# EAGLE schematic Eagle_Template (EAGLE 9.1.3)
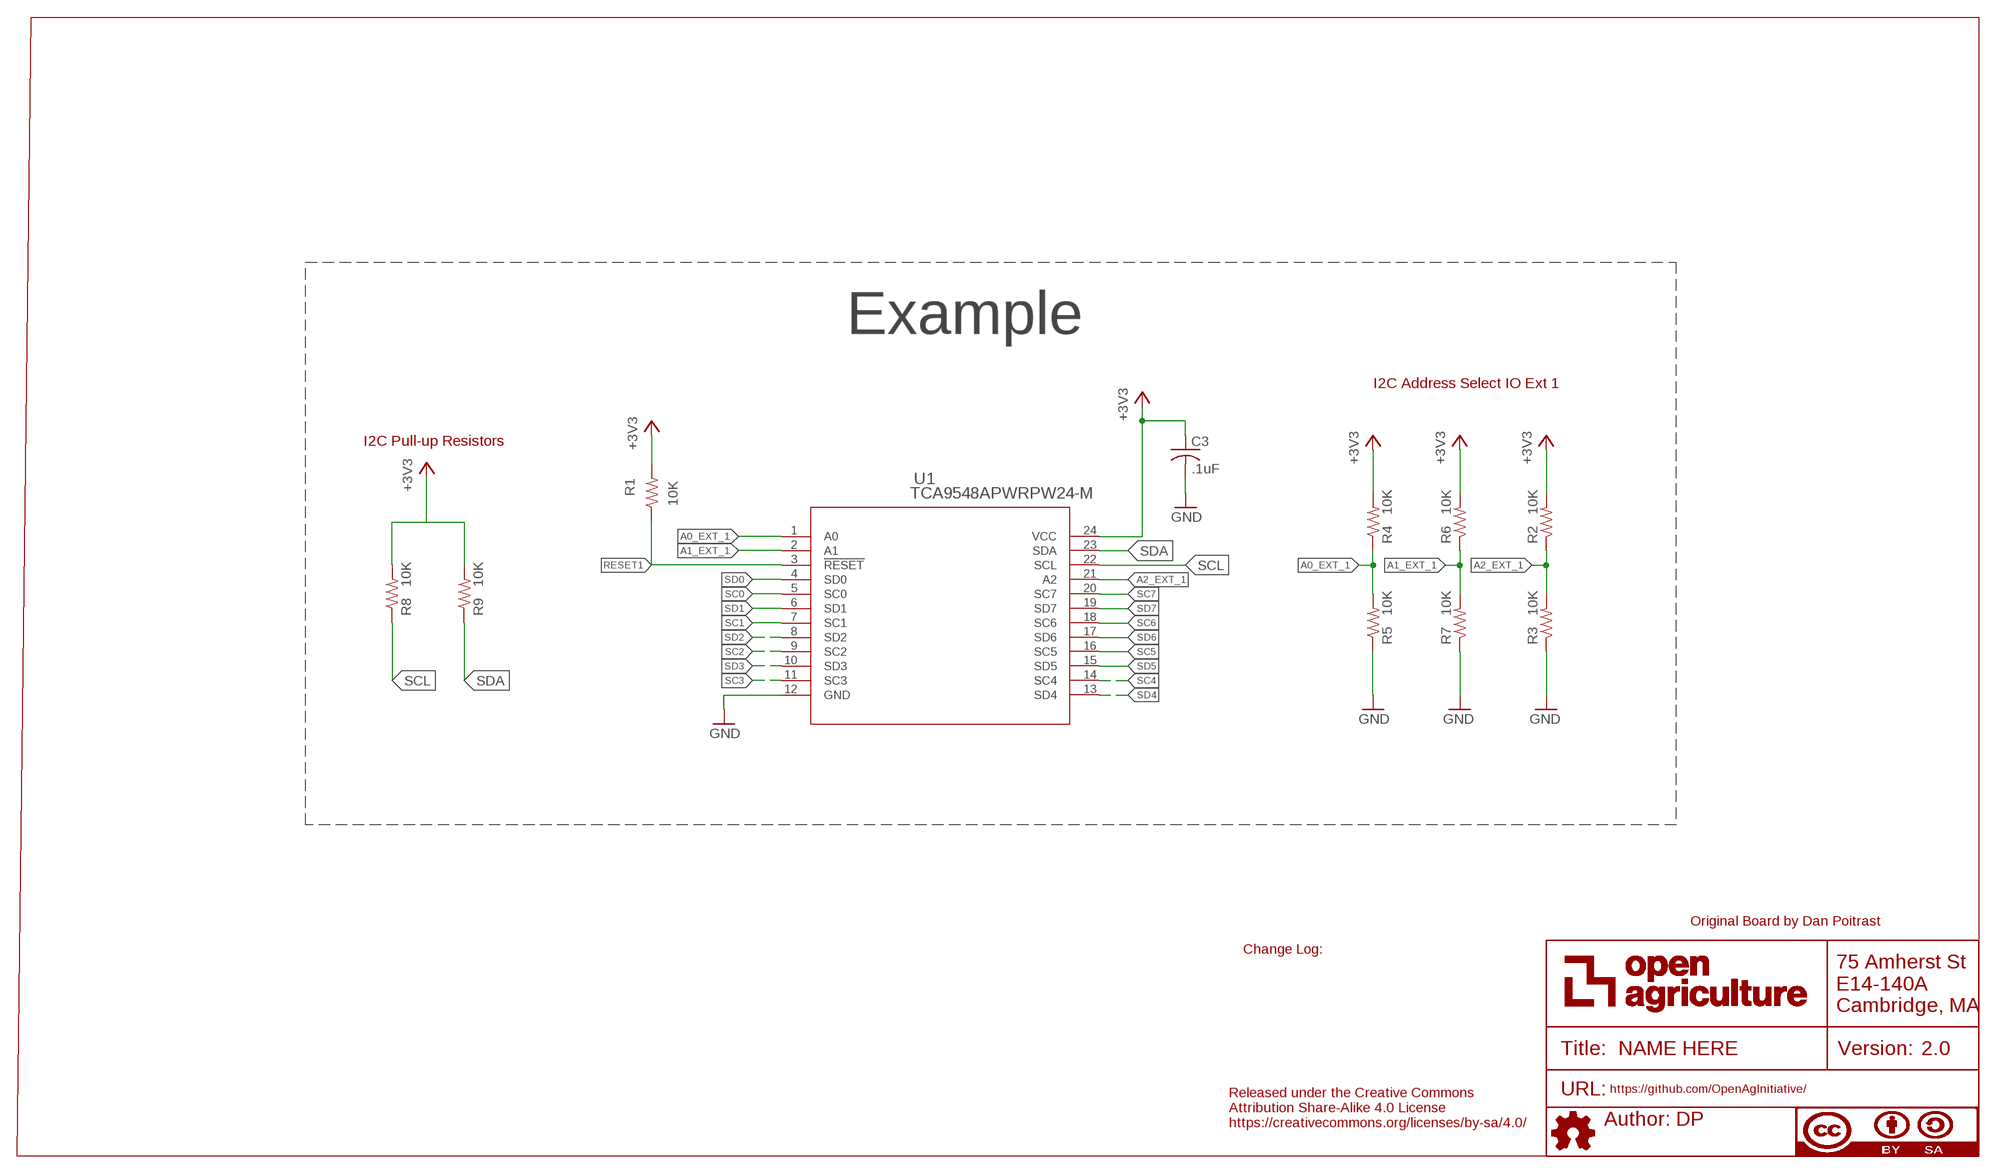
[diagram p0: schematic, sheet 1]

## Parts
ATTRIBUTES  DOCFIELD  [DOCFIELD]
C3  .1uF  C-USC0603  [C0603@1]
R1  10K  R-US_R0603  [R0603]
R2  10K  10KOHM-1/10W-1%(0603)0603  [0603-RES]
R3  10K  10KOHM-1/10W-1%(0603)0603  [0603-RES]
R4  10K  10KOHM-1/10W-1%(0603)0603  [0603-RES]
R5  10K  10KOHM-1/10W-1%(0603)0603  [0603-RES]
R6  10K  10KOHM-1/10W-1%(0603)0603  [0603-RES]
R7  10K  10KOHM-1/10W-1%(0603)0603  [0603-RES]
R8  10K  10KOHM-1/10W-1%(0603)0603  [0603-RES]
R9  10K  10KOHM-1/10W-1%(0603)0603  [0603-RES]
U1  TCA9548APWRPW24-M  [PW24-M]

## Nets
+3V3: C3.1 R1.2 R2.2 R4.2 R6.2 R8.2 R9.2 U1.24(VCC)
A0_EXT_1: R4.1 R5.2 U1.1(A0)
A1_EXT_1: R6.1 R7.2 U1.2(A1)
A2_EXT_1: R2.1 R3.2 U1.21(A2)
GND: C3.2 R3.1 R5.1 R7.1 U1.12(GND)
RESET1: R1.1 U1.3(!RESET)
SC0: U1.5(SC0)
SC1: U1.7(SC1)
SC2: U1.9(SC2)
SC3: U1.11(SC3)
SC4: U1.14(SC4)
SC5: U1.16(SC5)
SC6: U1.18(SC6)
SC7: U1.20(SC7)
SCL: R8.1 U1.22(SCL)
SD0: U1.4(SD0)
SD1: U1.6(SD1)
SD2: U1.8(SD2)
SD3: U1.10(SD3)
SD4: U1.13(SD4)
SD5: U1.15(SD5)
SD6: U1.17(SD6)
SD7: U1.19(SD7)
SDA: R9.1 U1.23(SDA)

## Notes on the sheet
- Example
- I2C Address Select IO Ext 1
- I2C Pull-up Resistors
- Original Board by Dan Poitrast
- Change Log:
- Released under the Creative Commons
  Attribution Share-Alike 4.0 License
  https://creativecommons.org/licenses/by-sa/4.0/

## Library data of the parts
ATTRIBUTES = openag-frames:DOCFIELD: DOCUMENT FIELD; AUTHOR: DP; MPN: N/A; TITLE: NAME HERE; URL: https://github.com/OpenAgInitiative/; VER: 2.0
C3 = rcl:C-US: CAPACITOR, American symbol
R1 = rcl:R-US_: RESISTOR, American symbol; SPICEPREFIX: R
R2-R9 = SparkFun-Resistors:10KOHM-1/10W-1%(0603): RES-00824; PROD_ID: RES-00824
U1 = OpenAG_I2C:TCA9548APWR; MANUFACTURER_PART_NUMBER: TCA9548APWR; VENDOR: TEXAS INSTRUMENTS

## Net classes
0 default: width 0.305 mm, drill 0.254 mm, clearance 0.254 mm